# EAGLE design 19K Keyboard (EAGLE 9.1.1)
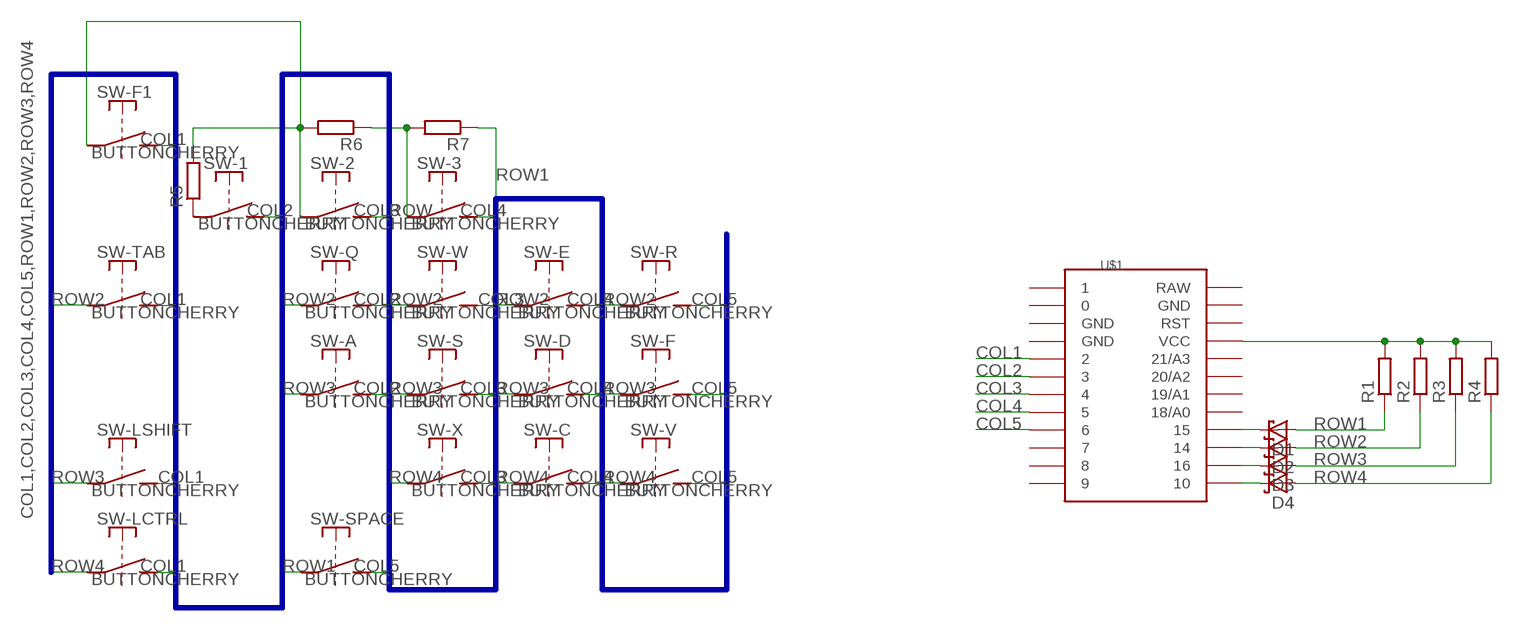
[diagram p0: schematic, sheet 1]

## Parts
D1  DIODE-SH_SOD523  [SODFL1608X65]
D2  DIODE-SH_SOD523  [SODFL1608X65]
D3  DIODE-SH_SOD523  [SODFL1608X65]
D4  DIODE-SH_SOD523  [SODFL1608X65]
R1  R_R1206  [RESC3216X60]
R2  R_R1206  [RESC3216X60]
R3  R_R1206  [RESC3216X60]
R4  R_R1206  [RESC3216X60]
R5  R_R0805  [RESC2012X50]
R6  R_R0805  [RESC2012X50]
R7  R_R0805  [RESC2012X50]
SW-1  BUTTONCHERRY  [SW_GATERON]
SW-2  BUTTONCHERRY  [SW_GATERON]
SW-3  BUTTONCHERRY  [SW_GATERON]
SW-A  BUTTONCHERRY  [SW_GATERON]
SW-C  BUTTONCHERRY  [SW_GATERON]
SW-D  BUTTONCHERRY  [SW_GATERON]
SW-E  BUTTONCHERRY  [SW_GATERON]
SW-F  BUTTONCHERRY  [SW_GATERON]
SW-F1  BUTTONCHERRY  [SW_GATERON]
SW-LCTRL  BUTTONCHERRY  [SW_GATERON]
SW-LSHIFT  BUTTONCHERRY  [SW_GATERON]
SW-Q  BUTTONCHERRY  [SW_GATERON]
SW-R  BUTTONCHERRY  [SW_GATERON]
SW-S  BUTTONCHERRY  [SW_GATERON]
SW-SPACE  BUTTONCHERRY  [SW_GATERON]
SW-TAB  BUTTONCHERRY  [SW_GATERON]
SW-V  BUTTONCHERRY  [SW_GATERON]
SW-W  BUTTONCHERRY  [SW_GATERON]
SW-X  BUTTONCHERRY  [SW_GATERON]
U$1  PROMICRO  [PROMICRO]

## Nets
COL1: SW-F1.P$2 SW-LCTRL.P$2 SW-LSHIFT.P$2 SW-TAB.P$2 U$1.2
COL2: SW-1.P$2 SW-A.P$2 SW-Q.P$2 U$1.3
COL3: SW-2.P$2 SW-S.P$2 SW-W.P$2 SW-X.P$2 U$1.4
COL4: SW-3.P$2 SW-C.P$2 SW-D.P$2 SW-E.P$2 U$1.5
COL5: SW-F.P$2 SW-R.P$2 SW-SPACE.P$2 SW-V.P$2 U$1.6
N$1: D1.1(C) U$1.15
N$2: D2.1(C) U$1.14
N$3: D3.1(C) U$1.16
N$4: D4.1(C) U$1.10
N$5: R5.1 SW-1.P$1
N$6: R5.2 R6.2 SW-2.P$1 SW-F1.P$1
N$9: R1.2 R2.2 R3.2 R4.2 U$1.VCC
ROW: R6.1 R7.2 SW-3.P$1
ROW1: D1.2(A) R1.1 R7.1 SW-SPACE.P$1
ROW2: D2.2(A) R2.1 SW-E.P$1 SW-Q.P$1 SW-R.P$1 SW-TAB.P$1 SW-W.P$1
ROW3: D3.2(A) R3.1 SW-A.P$1 SW-D.P$1 SW-F.P$1 SW-LSHIFT.P$1 SW-S.P$1
ROW4: D4.2(A) R4.1 SW-C.P$1 SW-LCTRL.P$1 SW-V.P$1 SW-X.P$1
Unconnected: U$1.7 U$1.8 U$1.9 U$1.18/A0 U$1.19/A1 U$1.20/A2 U$1.21/A3 U$1.GND@3(GND) U$1.RST

## Buses
COL1,COL2,COL3,COL4,COL5,ROW1,ROW2,ROW3,ROW4

## Power pins joined to a net without a drawn wire
0: U$1.0
1: U$1.1
GND: U$1.GND@1(GND) U$1.GND@2(GND)
RAW: U$1.RAW

## Library data of the parts
D1-D4 = Flamberm:DIODE-SH_
R1-R7 = Flamberm:R_
SW-1-SW-3 SW-A SW-C SW-D SW-E SW-F SW-F1 SW-LCTRL SW-LSHIFT SW-Q SW-R SW-S SW-SPACE SW-TAB SW-V SW-W SW-X = Flamberm:BUTTON
U$1 = Flamberm:PROMICRO

## Board
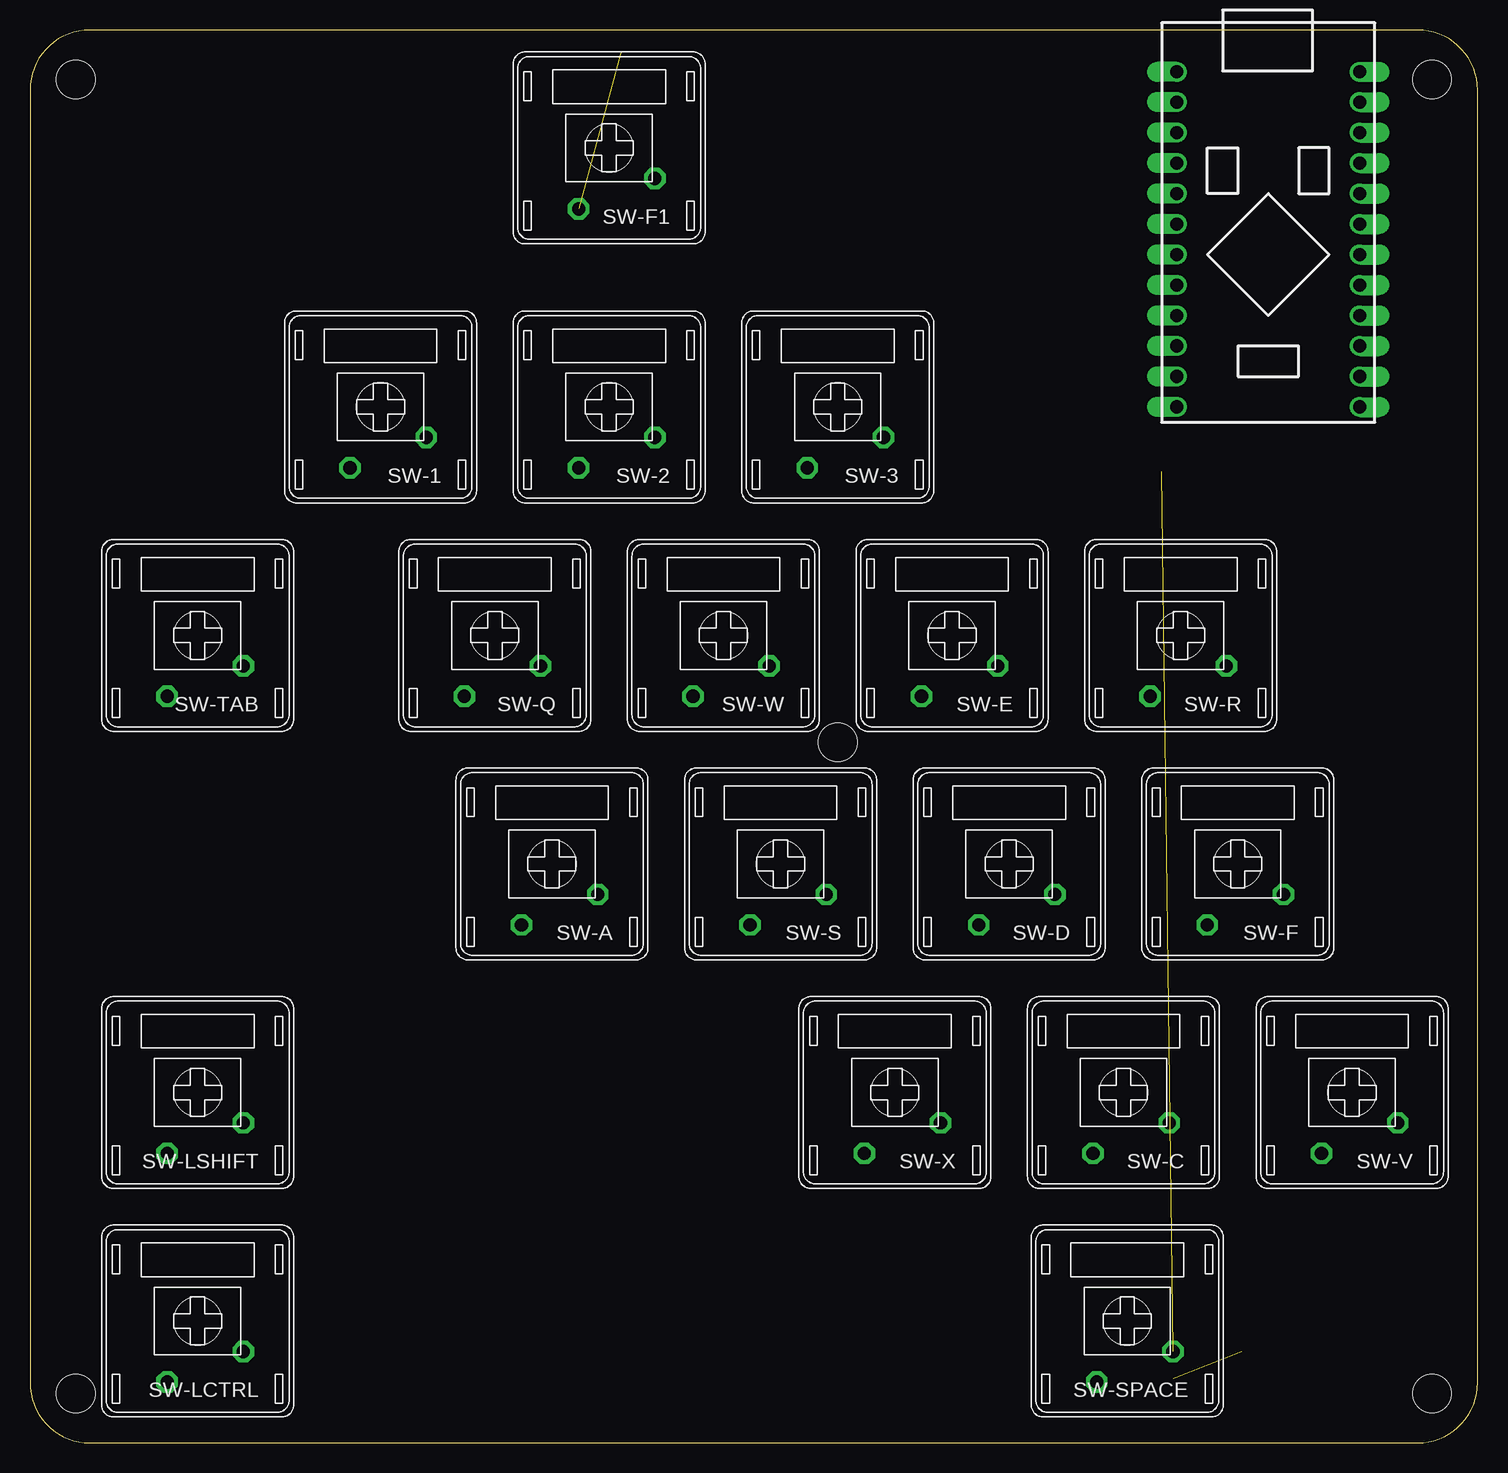
[diagram p1: board, top side]
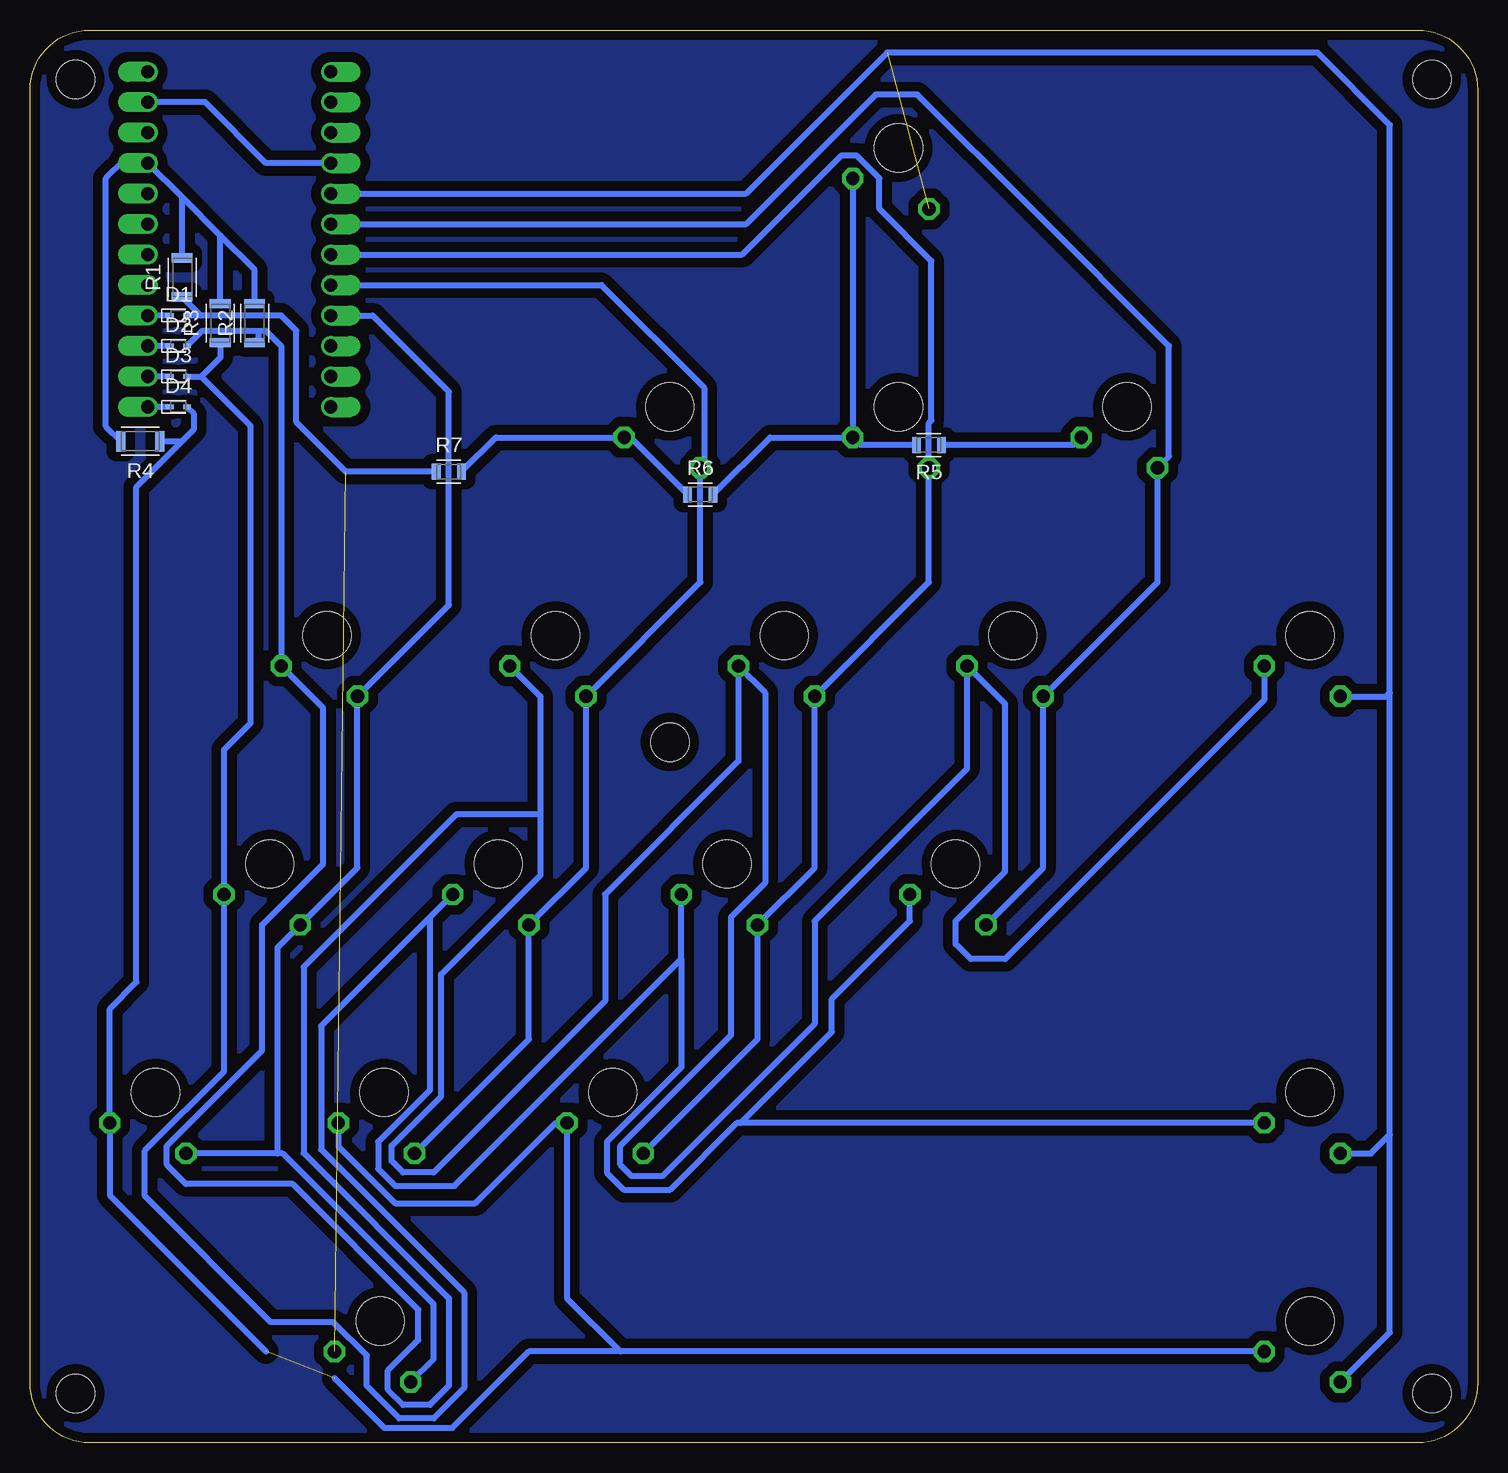
[diagram p2: board, bottom side, seen from below]

Size 120.63 x 117.78 mm. Coordinates in mm from the lower left corner, seen from the top.
Outline: 0,112.78 0,5 arc90 5,0 115.63,0 arc90 120.63,5 120.63,112.78 arc90 115.63,117.78 5,117.78 arc90 0,112.78
Copper layers (1*16): Top 0.035mm / dielectric 1.5mm / Bottom 0.035mm
Design rules "EagleDesignRules *": minimum track width 0.25mm, minimum drill 0.3mm, track to track 0.3mm, track to pad 0.3mm, pad to pad 0.3mm, via to via 0.3mm, smd to smd 0.25mm, copper to edge 0.5mm, drill to drill 0.5mm, minimum pad ring 10mil, minimum via ring 8mil, stop-mask expansion 4mil, vias tented up to drill 0mil, thermal gap 0.25mm
Holes 3.2 mm at 3.81,113.67 3.81,4.13 116.84,113.67 116.84,4.13 67.31,58.42

### Footprints (pad centres in the part's own frame; a part is rotated, then mirrored left to right if it is on the bottom)
SODFL1608X65 = smd 0.66 x 0.398: 1 -0.72,0; 2 0.72,0
RESC3216X60 = smd 0.762 x 1.712: 1 -1.625,0; 2 1.625,0
RESC2012X50 = smd 0.712 x 1.312: 1 -1.05,0; 2 1.05,0
SW_GATERON = drill 1.1 pad 1.778 octagon: P$1 -3.81,2.54; P$2 2.54,5.08 | hole 4: 0,0
PROMICRO = drill 1.1 offset: 0 -7.62,10.16; 1 -7.62,12.7; 2 -7.62,2.54; 3 -7.62,0; 4 -7.62,-2.54; 5 -7.62,-5.08; 6 -7.62,-7.62; 7 -7.62,-10.16; 8 -7.62,-12.7; 9 -7.62,-15.24; 10 7.62,-15.24; 14 7.62,-10.16; 15 7.62,-7.62; 16 7.62,-12.7; 18/A0 7.62,-5.08; 19/A1 7.62,-2.54; 20/A2 7.62,0; 21/A3 7.62,2.54; GND@1 7.62,10.16; GND@2 -7.62,5.08; GND@3 -7.62,7.62; RAW 7.62,12.7; RST 7.62,7.62; VCC 7.62,5.08

### Placement (x,y rotation side)
D1  108.27,93.98 0 bottom
D2  108.27,91.44 0 bottom
D3  108.27,88.9 0 bottom
D4  108.27,86.36 0 bottom
R1  107.95,97.16 90 bottom
R2  101.92,93.34 90 bottom
R3  104.78,93.34 90 bottom
R4  111.44,83.5 180 bottom
R5  45.72,83.19 180 bottom
R6  64.77,79.06 0 bottom
R7  85.72,80.96 0 bottom
SW-1  29.21,86.36 180 top
SW-2  48.26,86.36 180 top
SW-3  67.31,86.36 180 top
SW-A  43.5,48.26 180 top
SW-C  91.12,29.21 180 top
SW-D  81.6,48.26 180 top
SW-E  76.83,67.31 180 top
SW-F  100.65,48.26 180 top
SW-F1  48.26,107.95 180 top
SW-LCTRL  13.97,10.16 180 top
SW-LSHIFT  13.97,29.21 180 top
SW-Q  38.73,67.31 180 top
SW-R  95.89,67.31 180 top
SW-S  62.55,48.26 180 top
SW-SPACE  91.44,10.16 180 top
SW-TAB  13.97,67.31 180 top
SW-V  110.17,29.21 180 top
SW-W  57.78,67.31 180 top
SW-X  72.07,29.21 180 top
U$1  103.19,101.6 0 top

### Tracks (layer width: path | path; a pad name or v marks a point on that pad's centre or on a via)
COL1  (1 unrouted)
  Bottom 0.508: SW-LCTRL.P$2 7.3,9.21 7.3,25.72 | SW-LSHIFT.P$2 8.89,24.13 7.3,25.72 | 7.3,25.72 7.3,62.55 | 7.3,62.55 7.3,109.86 13.34,115.89 49.21,115.89 60.96,104.14 U$1.2 | SW-TAB.P$2 7.62,62.23 7.3,62.55
COL2
  Bottom 0.508: SW-A.P$2 36.2,47.94 SW-Q.P$2 26.67,71.75 SW-1.P$2 25.72,82.23 25.72,91.44 37.15,102.87 46.67,112.39 50.16,112.39 60.96,101.6 U$1.3
COL3
  Bottom 0.508: SW-X.P$2 60.01,33.66 SW-S.P$2 55.24,47.94 SW-W.P$2 45.72,71.75 SW-2.P$2 45.72,85 45.51,85.22 45.51,98.53 49.85,102.87 49.85,105.41 51.75,107.31 53.02,107.31 61.28,99.06 U$1.4
COL4
  Bottom 0.508: SW-C.P$2 79.06,33.66 SW-D.P$2 74.3,47.94 SW-E.P$2 64.77,71.75 SW-3.P$2 64.45,81.6 64.45,87.95 73.03,96.52 U$1.5
COL5
  Bottom 0.508: SW-SPACE.P$2 87,6.99 87,11.56 99.57,24.13 100.01,24.13 | 100.01,24.13 SW-V.P$2 | 100.01,24.13 100.01,41.27 SW-F.P$2 93.34,47.94 SW-R.P$2 85.72,69.85 85.72,87.63 92.08,93.98 U$1.6
GND
  Bottom 0.508: U$1.GND@2 100.97,106.68 106.05,111.76 U$1.GND@1
N$1
  Bottom 0.508: D1.1 U$1.15
N$2
  Bottom 0.508: D2.1 U$1.14
N$3
  Bottom 0.508: D3.1 U$1.16
N$4
  Bottom 0.508: D4.1 U$1.10
N$5
  Bottom 0.508: SW-1.P$1 33.66,83.19 R5.1
N$6
  Bottom 0.508: R5.2 51.44,83.19 SW-2.P$1 | R6.2 58.96,83.82 SW-2.P$1 | SW-F1.P$1 SW-2.P$1
N$7
  pour Bottom (isolate 0.813): 115.63,0 5,0 arc-90 0,5 0,112.78 arc-90 5,117.78 115.63,117.78 arc-90 120.63,112.78 120.63,5 arc-90
N$9
  Bottom 0.508: R4.2 114.3,84.73 114.3,105.41 112.71,107 111.12,107 U$1.VCC 107.95,103.82 | R1.2 107.95,103.82 | R2.2 101.92,97.79 104.78,100.65 | 104.78,100.65 107.95,103.82 | R3.2 104.78,100.65
ROW
  Bottom 0.508: R6.1 70.58,83.82 SW-3.P$1 81.82,83.82 R7.2
ROW1  (1 unrouted)
  Bottom 0.508: R7.1 94.3,80.96 98.42,85.09 98.42,92.71 99.69,93.98 106.36,93.98 106.4,93.98 | 106.4,93.98 D1.2 | R1.1 106.4,93.98
ROW2
  Bottom 0.508: SW-TAB.P$1 17.78,61.91 39.37,40.32 42.23,40.32 43.5,41.59 43.5,43.5 39.37,47.62 39.37,61.59 SW-Q.P$1 42.55,56.2 55.24,43.5 55.24,34.92 67.94,22.23 70.48,22.23 71.44,23.18 71.44,24.77 62.23,33.97 62.23,43.81 59.37,46.67 59.37,62.55 SW-W.P$1 61.59,56.83 72.71,45.72 72.71,36.83 87,22.54 89.53,22.54 90.49,23.5 90.49,24.77 86.36,28.89 86.36,39.05 78.11,47.31 78.11,52.39 | 78.11,52.39 78.11,62.23 SW-E.P$1 | 78.11,52.39 85.09,52.39 97.82,39.66 97.82,24.16 85.72,12.06 85.72,4.76 87.31,3.17 89.53,3.17 90.81,4.45 90.81,6.03 88.27,8.57 88.27,11.11 98.74,21.59 107.63,21.59 109.22,23.18 109.22,24.77 101.28,32.7 101.28,43.18 96.2,48.26 96.2,61.28 SW-R.P$1 99.69,91.44 100.97,92.71 101.6,92.71 | 101.6,92.71 106.28,92.71 D2.2 | 101.6,92.71 101.6,92.04 R2.1
ROW3
  Bottom 0.508: 87.31,43.81 SW-D.P$1 | 66.36,40.32 SW-S.P$1 | SW-A.P$1 47.31,43.5 53.8,37 53.8,34.27 61.41,26.67 | 66.36,40.32 66.36,31.3 72.56,25.1 72.56,22.52 71.14,21.1 67.29,21.1 61.72,26.67 61.41,26.67 | 66.36,40.32 85.26,21.42 90.19,21.42 91.61,22.84 91.61,25.1 87.31,29.4 87.31,43.81 | 87.31,43.81 96.38,34.75 96.38,24.46 84.45,12.54 84.45,4.57 86.98,2.05 89.87,2.05 92.57,4.75 92.57,7.29 95.34,10.07 100.56,10.07 111.06,20.57 111.06,24.38 104.46,30.99 SW-F.P$1 104.46,57.78 102.23,60.01 102.23,84.77 106.36,88.9 | SW-LSHIFT.P$1 61.41,26.67 | D3.2 106.36,88.9 | R3.1 104.78,90.49 106.36,88.9
ROW4  (1 unrouted)
  Bottom 0.508: 100.97,7.62 113.98,20.64 SW-V.P$1 113.98,36.2 111.76,38.42 111.76,79.69 107.95,83.5 | 95.25,5.4 91.09,1.24 85.44,1.24 79.06,7.62 71.44,7.62 | D4.2 107,85.81 107,84.45 107.95,83.5 | SW-C.P$1 94.93,24.7 90.2,19.97 83.53,19.97 76.83,26.67 SW-X.P$1 75.88,12.06 71.44,7.62 | SW-LCTRL.P$1 71.44,7.62 | R4.1 107.95,83.5